# EAGLE schematic basic_circuit (EAGLE 9.6.2)
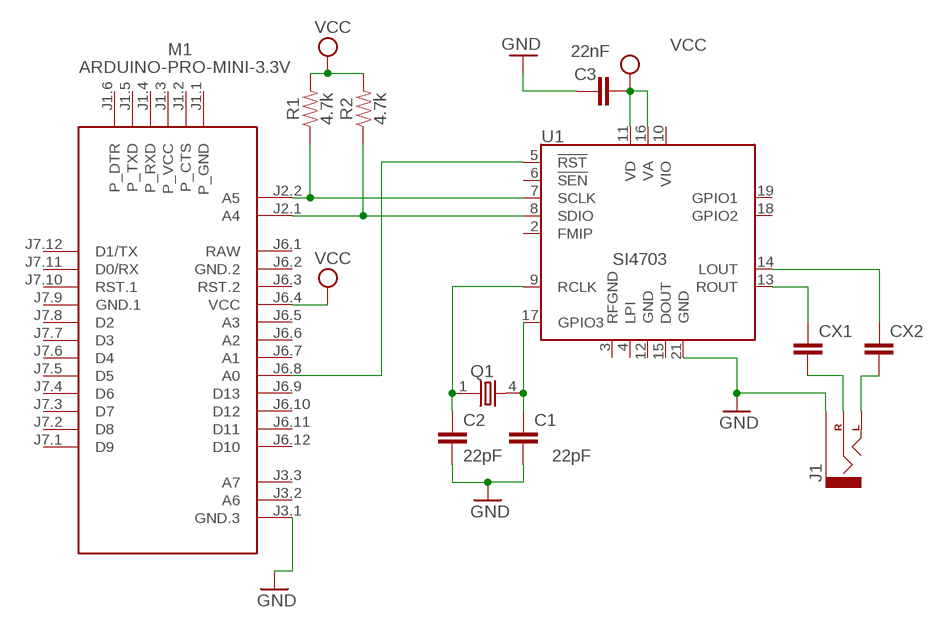
[diagram p0: schematic, sheet 1]

## Parts
C1  22pF  C2,5-3  [C2.5-3]
C2  22pF  C2,5-3  [C2.5-3]
C3  22nF  C2,5-3  [C2.5-3]
CX1  CXXC10B6  [XC10B6]
CX2  CXXC10B6  [XC10B6]
J1  AUDIO_JACK_2.5MM_HOLESONLY  [STEREOJACK2.5MM_SPECIAL_HOLES-ONLY]
M1  ARDUINO-PRO-MINI-3.3V  [ARDUINO-PRO-MINI]
Q1  86SMX  [86SMX]
R1  4.7k  4.7KOHM-0603-1/10W-1%  [0603]
R2  4.7k  4.7KOHM-0603-1/10W-1%  [0603]
U1  SI4703  [QFN-20-3X3MM]

## Nets
GND: C1.2 C2.2 C3.1 J1.RING1(SLEEVE) M1.J3.1(GND.3) U1.21(GND)
N$1: M1.J2.2(A5) R1.1 U1.7(SCLK)
N$2: M1.J2.1(A4) R2.1 U1.8(SDIO)
N$3: M1.J6.8(A0) U1.5(!RST)
N$4: C1.1 Q1.4 U1.17(GPIO3)
N$5: C2.1 Q1.1 U1.9(RCLK)
N$16: CX1.1 U1.13(ROUT)
N$19: CX2.1 U1.14(LOUT)
N$20: CX1.2 J1.TIP(RIGHT)
N$21: CX2.2 J1.SHIELD(LEFT)
VCC: C3.2 M1.J6.4(VCC) R1.2 R2.2 U1.11(VD) U1.16(VA)
Unconnected: M1.J1.1(P_GND) M1.J1.2(P_CTS) M1.J1.3(P_VCC) M1.J1.4(P_RXD) M1.J1.5(P_TXD) M1.J1.6(P_DTR) M1.J3.2(A6) M1.J3.3(A7) M1.J6.3(RST.2) M1.J6.5(A3) M1.J6.6(A2) M1.J6.7(A1) M1.J6.9(D13) M1.J6.10(D12) M1.J6.11(D11) M1.J6.12(D10) M1.J7.1(D9) M1.J7.2(D8) M1.J7.3(D7) M1.J7.4(D6) M1.J7.5(D5) M1.J7.6(D4) M1.J7.7(D3) M1.J7.8(D2) M1.J7.10(RST.1) M1.J7.11(D0/RX) M1.J7.12(D1/TX) U1.2(FMIP) U1.3(RFGND) U1.4(LPI) U1.6(!SEN) U1.10(VIO) U1.12(GND) U1.15(DOUT) U1.18(GPIO2) U1.19(GPIO1)

## Power pins joined to a net without a drawn wire
GND.1: M1.J7.9(GND.1)
GND.2: M1.J6.2(GND.2)
RAW: M1.J6.1(RAW)

## Library data of the parts
C1-C3 = capacitor-wima:C: CAPACITOR naming: grid - package width
CX1 CX2 = rcl:CX: X CAPACITOR for power line; SPICEPREFIX: C
J1 = SparkFun-Connectors:AUDIO_JACK_2.5MM: Audio Jack 2.5mm variants of PTH and SMT audio jacks. SparkFun Products: SparkFun PicoBoard <https://www.sparkfun.com/products/11888>- 2.5mm SMD
M1 = diy-modules:ARDUINO-PRO-MINI-*: Arduino Pro Mini and compatible devices More details available here: https://www.arduino.cc/en/Main/ArduinoBoardProMini Click here to find device on ebay.com <http://www.ebay.com/sch/arduino+pro+mini>
Q1 = crystal:86SMX: CRYSTAL; MF: C-MAC FREQUENCY PRODUCTS LTD; MPN: XTAL003321- 86SMX; OC_FARNELL: 6344914; OC_NEWARK: 01H9866
R1 R2 = SparkFun-Resistors:4.7KOHM: 4.7kΩ resistor A resistor is a passive two-terminal electrical component that implements electrical resistance as a circuit element. Resistors act to reduce current flow, and, at the same time, act to lower voltage levels within circuits. - Wikipedia; PROD_ID: RES-07857
U1 = SI4703:SI4703: Silicon Labs Si4703 FM Tuner Beyond enabling you to tune in to FM radio stations, the Si4703 is also capable of detecting and processing both Radio Data Service (RDS) and Radio Broadcast Data Service (RBDS) information. The Si4703 even does a very good job of filtering and carrier detection. It also enables data such as the station ID and song name to be displayed to the user. SparkFun Products SparkFun FM Tuner Evaluation Board - Si4703 <https://www.sparkfun.com/products/12938> (WRL-12938) SparkFun FM Tuner Basic Breakout - Si4703 <https://www.sparkfun.com/products/11083> (WRL-11083) FabFM Radio Kit <https://www.sparkfun.com/products/11043> (KIT-11043); AVAILABILITY: Unavailable; DESCRIPTION: - Tuner For Use With Si4703; MF: SparkFun Electronics; MP: SI4703; PACKAGE: UFQFN-20 SparkFun Electronics; PRICE: None